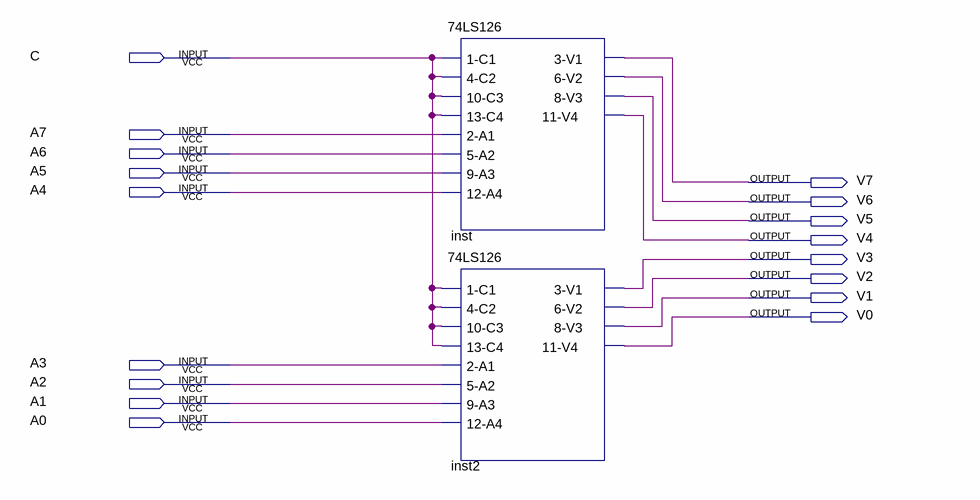
[diagram p0: schematic sheet]
// Quartus schematic Sub3State.bdf as structural Verilog: 2 symbols, 17 pins
module Sub3State (
  input  C,
  input  A7,
  input  A6,
  input  A5,
  input  A4,
  input  A3,
  input  A2,
  input  A1,
  input  A0,
  output V7,
  output V6,
  output V5,
  output V4,
  output V3,
  output V2,
  output V1,
  output V0
);

  \74LS126  inst (
    .\1-C1 (C), .\4-C2 (C), .\10-C3 (C), .\13-C4 (C), .\2-A1 (A7), .\5-A2 (A6), .\9-A3 (A5), .\12-A4 (A4),
    .\3-V1 (V7), .\6-V2 (V6), .\8-V3 (V5), .\11-V4 (V4));
  \74LS126  inst2 (
    .\1-C1 (C), .\4-C2 (C), .\10-C3 (C), .\13-C4 (C), .\2-A1 (A3), .\5-A2 (A2), .\9-A3 (A1), .\12-A4 (A0),
    .\3-V1 (V3), .\6-V2 (V2), .\8-V3 (V1), .\11-V4 (V0));
endmodule
